# EAGLE schematic bjt_NPN (EAGLE 7.5.0)
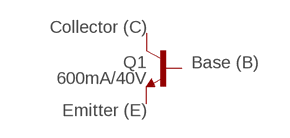
[diagram p0: schematic, sheet 1]

## Parts
Q1  600mA/40V  TRANS_NPN-P2N2222A  [TO-92]
Unconnected: Q1.1(C) Q1.2(B) Q1.3(E)

## Notes on the sheet
- Collector (C)
- Base (B)
- Emitter (E)

## Library data of the parts
Q1 = SparkFun-DiscreteSemi:TRANS_NPN: NPN transistor Current controlled devices typically used to amplify current or used as a switch. BC547 - COM-08928 <http://www.sparkfun.com/products/8928> (TO-92 45V 100mA) (1.Collector 2.Base 3.Emitter) 2N3904 - COM-00521 <http://www.sparkfun.com/products/521> (TO-92 40V 200mA) (1.Emitter 2.Base 3.Collector) P2N2222A - COM-12852 <http://www.sparkfun.com/products/12852> (TO-92 40V 600mA) (1.Collector 2.Base 3.Emitter); PROD_ID: TRANS-09536